# Altium schematic sheet MCU.SchDoc: Smart Nursery Guardian
size 584 x 243 mm; DrawnBy: Tharaa Mohamed; Organization: Team 6 Mind Cloud; Revision: V1.0; SheetNumber: 2; SheetTotal: 2
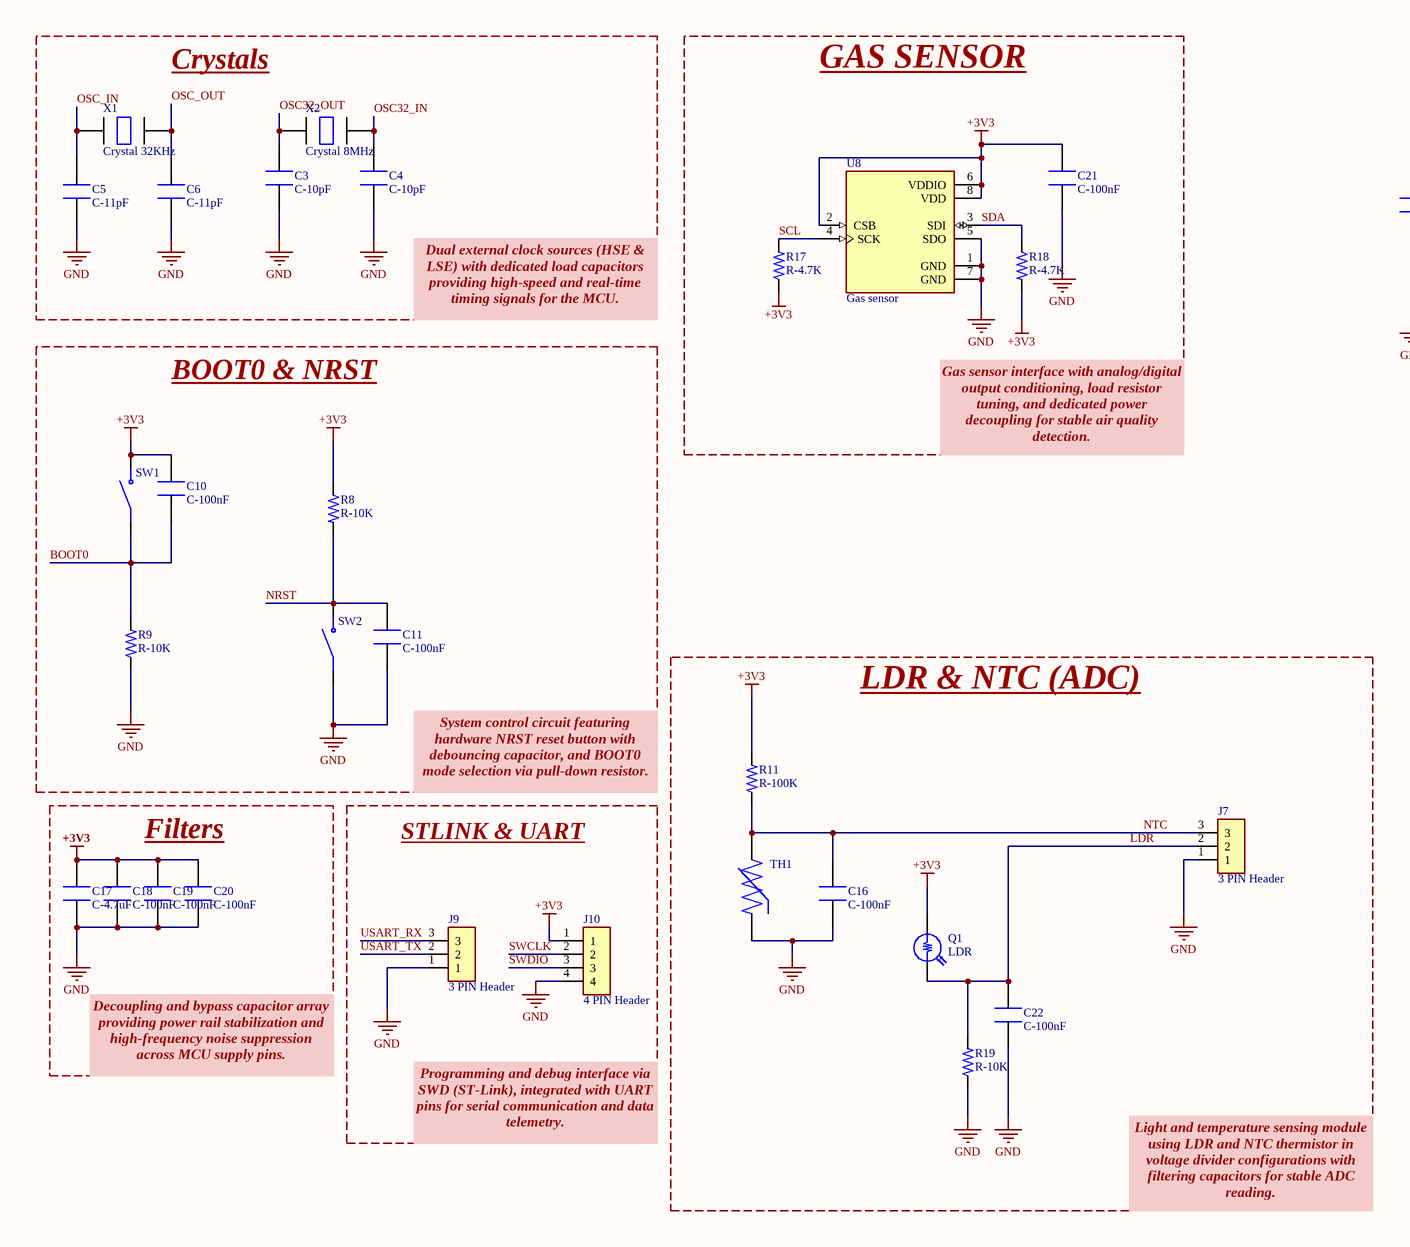
[diagram p0: MCU.SchDoc, left]
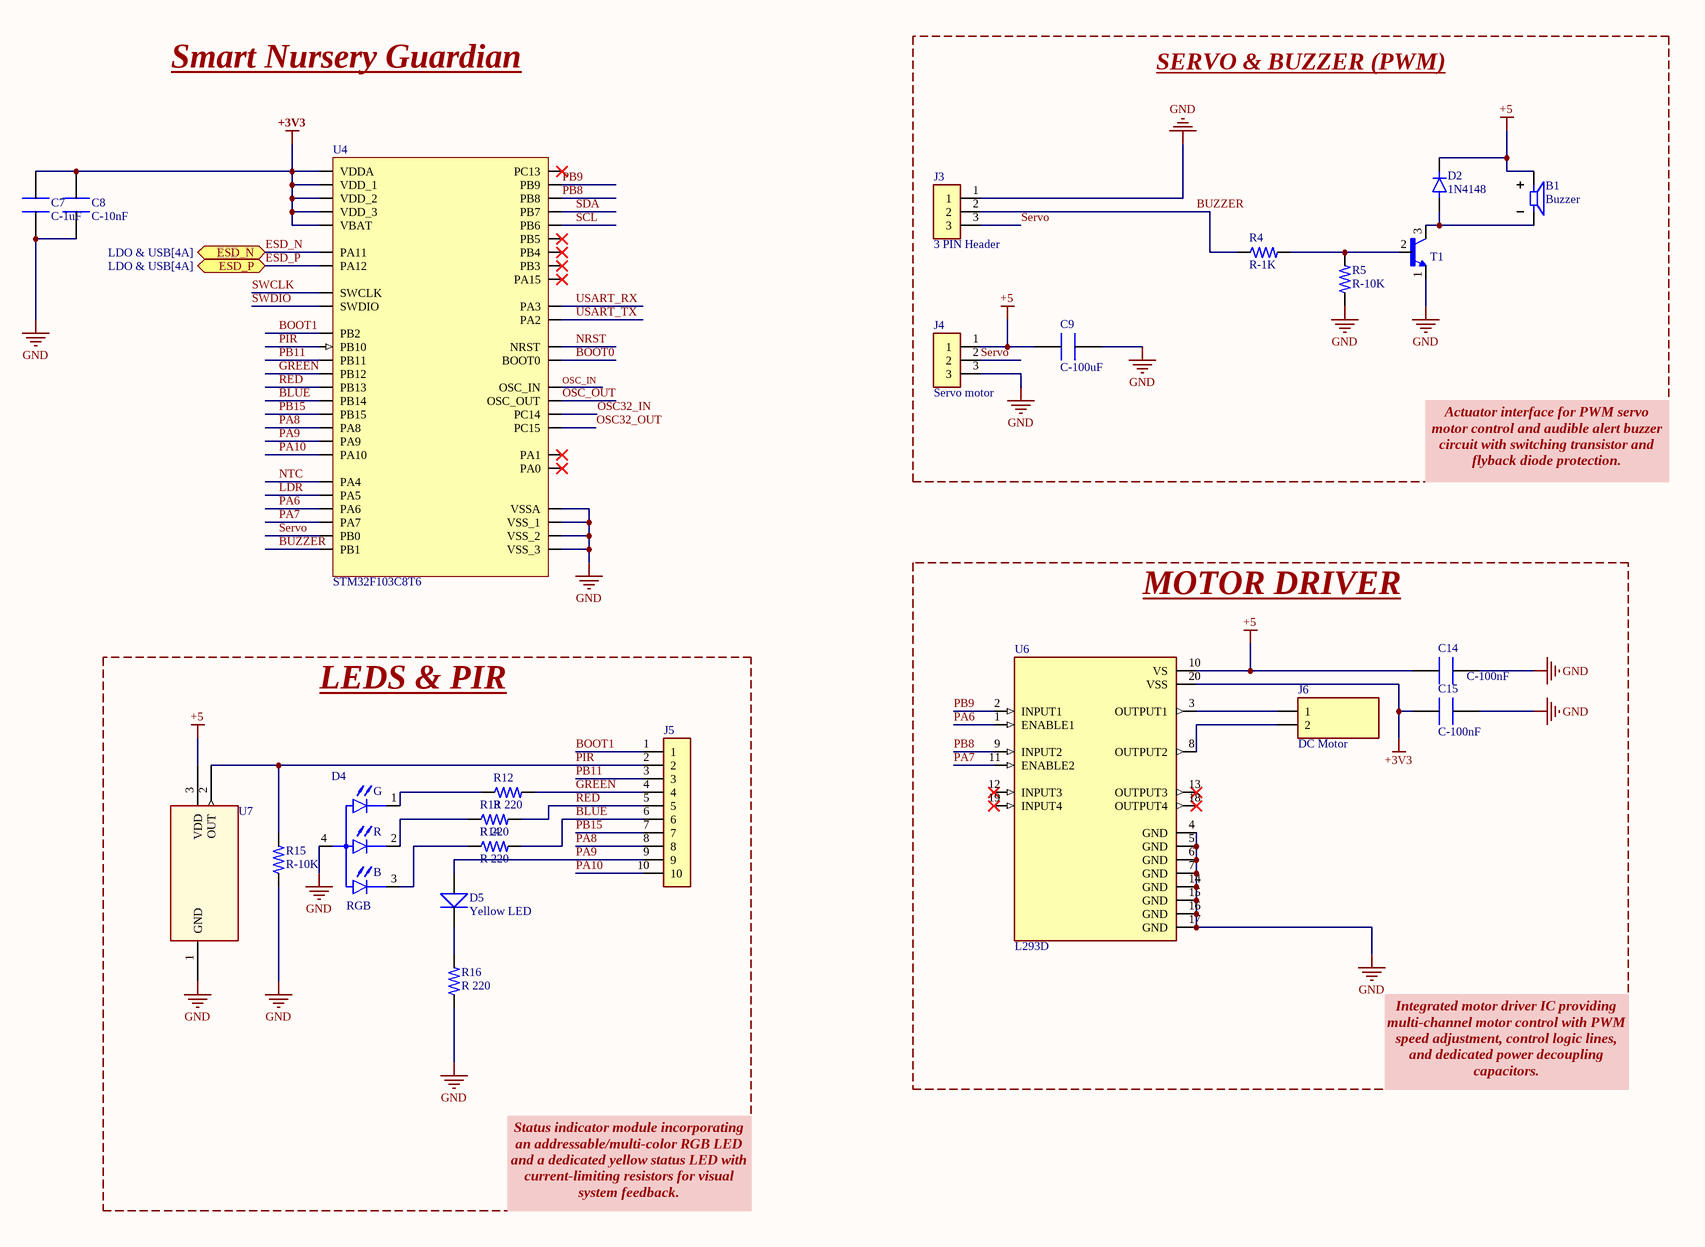
[diagram p1: MCU.SchDoc, right]

## Parts
B1  Buzzer  [Buzzer]
C3  C-10pF  [C-10pF]
C4  C-10pF  [C-10pF]
C5  C-11pF  [C-10pF]
C6  C-11pF  [C-10pF]
C7  C-1uF  [CAPC0804X80N]
C8  C-10nF  [CAPC0804X80N]
C9  C-100uF  [CAPC1709X35N]
C10  C-100nF  [CAPC1007X45N]
C11  C-100nF  [CAPC1007X45N]
C14  C-100nF  [CAPC1007X45N]
C15  C-100nF  [CAPC1007X45N]
C16  C-100nF  [CAPC1007X45N]
C17  C-4.7uF  [CAPC1007X45N]
C18  C-100nF  [CAPC1007X45N]
C19  C-100nF  [CAPC1007X45N]
C20  C-100nF  [CAPC1007X45N]
C21  C-100nF  [CAPC1007X45N]
C22  C-100nF  [CAPC1007X45N]
D2  1N4148  [DIOM3413X180N]
D4  RGB  [RGB]
D5  Yellow LED  [Green LED]
J3  3 PIN Header  [PIN 3 Header]
J4  Servo motor  [PIN 3 Header]
J5  10 PIN Header  [10 PIN Header]  (value not drawn)
J6  DC Motor  [2 PIN Header]
J7  3 PIN Header  [PIN 3 Header]
J9  3 PIN Header  [PIN 3 Header]
J10  4 PIN Header  [Header 4pin]
Q1  LDR  [LDR]
R4  R-1K  [RESC0804X45N]
R5  R-10K  [R-10K]
R8  R-10K  [R-10K]
R9  R-10K  [R-10K]
R11  R-100K  [RESC0503X35N]
R12  R 220  [R-220]
R13  R 220  [R-220]
R14  R 220  [R-220]
R15  R-10K  [R-10K]
R16  R 220  [R-220]
R17  R-4.7K  [RESC1007X50N]
R18  R-4.7K  [RESC1007X50N]
R19  R-10K  [R-10K]
SW1  SWITCH  [SWITCH]  (value not drawn)
SW2  SWITCH  [SWITCH]  (value not drawn)
T1  2N2222  [2N2222]  (value not drawn)
TH1  NTC Thermistor  [NTC]  (value not drawn)
U4  STM32F103C8T6  [STM32]
U6  L293D  [L293D]
U7  PIR  [PIR]  (value not drawn)
U8  Gas sensor  [Gas sensor]
X1  Crystal 32KHz  [Crystal 32KHz]
X2  Crystal 8MHz  [crystal 8Mz]

## Blocks framed on the sheet
Crystals: C3-C6 X1 X2
GAS SENSOR: C21 R17 R18 U8
SERVO & BUZZER (PWM): B1 C9 D2 J3 J4 R4 R5 T1
BOOT0 & NRST: C10 C11 R8 R9 SW1 SW2
MOTOR DRIVER: C14 C15 J6 U6
LDR & NTC (ADC): C16 C22 J7 Q1 R11 R19 TH1
LEDS & PIR: D4 D5 J5 R12-R16 U7
Filters: C17-C20
STLINK & UART: J9 J10

## Ports
ESD_N (bidir, see LDO & USB[4A]), ESD_P (bidir, see LDO & USB[4A])

## Nets
+3V3: C7.2 C8.2 C10.2 C15.1 C17.2 C18.2 C19.2 C20.2 C21.2 J10.1 Q1.1 R8.1 R11.2 R17.1 R18.2 SW1.2 U4.1(VBAT) U4.9(VDDA) U4.24(VDD_1) U4.36(VDD_2) U4.48(VDD_3) U6.20(VSS) U8.2(CSB) U8.6(VDDIO) U8.8(VDD)
+5: B1.P C9.1 C14.2 D2.K J4.1 U6.10(VS) U7.3(VDD)
GND: C3.1 C4.1 C5.1 C6.1 C7.1 C8.1 C9.2 C11.1 C14.1 C15.2 C16.1 C17.1 C18.1 C19.1 C20.1 C21.1 C22.1 D4.4(A) J3.1 J4.3 J7.1 J9.1 J10.4 R5.1 R9.1 R15.1 R16.1 R19.1 SW2.1 T1.1(E) TH1.1 U4.8(VSSA) U4.23(VSS_1) U4.35(VSS_2) U4.47(VSS_3) U6.4(GND) U6.5(GND) U6.6(GND) U6.7(GND) U6.14(GND) U6.15(GND) U6.16(GND) U6.17(GND) U7.1(GND) U8.1(GND) U8.5(SDO) U8.7(GND)
BLUE: J5.6 R14.2 U4.27(PB14)
BOOT0: C10.1 R9.2 SW1.1 U4.44(BOOT0)
BOOT1: J5.1 U4.20(PB2)
BUZZER: J3.2 R4.1 U4.19(PB1)
ESD_N: U4.32(PA11) ; port ESD_N
ESD_P: U4.33(PA12) ; port ESD_P
GREEN: J5.4 R12.2 U4.25(PB12)
LDR: C22.2 J7.2 Q1.2 R19.2 U4.15(PA5)
NRST: C11.2 R8.2 SW2.2 U4.7(NRST)
NTC: C16.2 J7.3 R11.1 TH1.2 U4.14(PA4)
OSC32_IN: C4.2 U4.3(PC14) X2.2
OSC32_OUT: C3.2 U4.4(PC15) X2.1
OSC_IN: C5.2 U4.5(OSC_IN) X1.1
OSC_OUT: C6.2 U4.6(OSC_OUT) X1.2
PA6: U4.16(PA6) U6.1(ENABLE1)
PA7: U4.17(PA7) U6.11(ENABLE2)
PA8: J5.8 U4.29(PA8)
PA9: D5.2 J5.9 U4.30(PA9)
PA10: J5.10 U4.31(PA10)
PB8: U4.45(PB8) U6.9(INPUT2)
PB9: U4.46(PB9) U6.2(INPUT1)
PB11: J5.3 U4.22(PB11)
PB15: J5.7 U4.28(PB15)
PIR: J5.2 R15.2 U4.21(PB10) U7.2(OUT)
RED: J5.5 R13.2 U4.26(PB13)
SCL: R17.2 U4.42(PB6) U8.4(SCK)
SDA: R18.1 U4.43(PB7) U8.3(SDI)
Servo: J3.3 J4.2 U4.18(PB0)
SWCLK: J10.2 U4.37(SWCLK)
SWDIO: J10.3 U4.34(SWDIO)
USART_RX: J9.3 U4.13(PA3)
USART_TX: J9.2 U4.12(PA2)
NetB1_N: B1.N D2.A T1.3(C)
NetD4_1: D4.1(C1) R12.1
NetD4_2: D4.2(C2) R13.1
NetD4_3: D4.3(C3) R14.1
NetD5_1: D5.1 R16.2
NetJ6_1: J6.1 U6.3(OUTPUT1)
NetJ6_2: J6.2 U6.8(OUTPUT2)
NetR4_2: R4.2 R5.2 T1.2(B)

Not connected (* = marked no-connect by the designer): U4 2(PC13)* 10(PA0)* 11(PA1)* 38(PA15)* 39(PB3)* 40(PB4)* 41(PB5)*; U6 12(INPUT3)* 13(OUTPUT3)* 18(OUTPUT4)* 19(INPUT4)*

## Notes on the sheet
- Smart Nursery Guardian
- Dual external clock sources (HSE & LSE) with dedicated load capacitors providing high-speed and real-time timing signals for the MCU.
- Gas sensor interface with analog/digital output conditioning, load resistor tuning, and dedicated power decoupling for stable air quality detection.
- Actuator interface for PWM servo motor control and audible alert buzzer circuit with switching transistor and flyback diode protection.
- System control circuit featuring hardware NRST reset button with debouncing capacitor, and BOOT0 mode selection via pull-down resistor.
- Decoupling and bypass capacitor array providing power rail stabilization and high-frequency noise suppression across MCU supply pins.
- Integrated motor driver IC providing multi-channel motor control with PWM speed adjustment, control logic lines, and dedicated power decoupling capacitors.
- Programming and debug interface via SWD (ST-Link), integrated with UART pins for serial communication and data telemetry.
- Light and temperature sensing module using LDR and NTC thermistor in voltage divider configurations with filtering capacitors for stable ADC reading.
- Status indicator module incorporating an addressable/multi-color RGB LED and a dedicated yellow status LED with current-limiting resistors for visual system feedback.
- (in symbol RGB) G; R; B

## Library data of the parts
B1 = Buzzer: Through Hole Alarms, Buzzers, and Sirens RoHS; MFR: CUI; MFR Part#: CMI-1210-5-95T; Supplier: LCSC; Supplier Part#: C6485139; ComponentLink1Description: New link; ComponentLink1URL: https://www.lcsc.com/product-detail/C6485139.html?s_z=n_q_CMI-1210-5-95T&spm=wm.fly.bg.0.xh&lcsc_vid=T1EIXgIEFgJdUgdfFAVeA1ADFlcIAQJWFVRdA1ZXFlMxVlNeT1JbX1FfQ1lXVDsOAxUeFF5JWBYZEEoKFBINSQcJGk4eFQsCAgIaSgADAwAHC0slRlNXVlFXWQkaCgg%3D
C3 C4 = C-10pF: MFR: Samsung Electro-Mechanics; MFR PART #: CL10C100JB8NNNC; SUPPLIER: LCSC; SUPPLIER PART #: C1634; ComponentLink1Description: New link; ComponentLink1URL: C1634
C5 C6 = C-11pF: MFR: muRata; MFR PART: GRM0335C1E110JA01D; SUPPLIER: LCSC; SUPPLIER PART #: C2183483
C7 = C-1uF: MFR: Samsung Electro-Mechanics; MFR PART#: CL10B105KA8NNNC; SUPPLIER: LCSC; ComponentLink1Description: New link; ComponentLink1URL: https://www.lcsc.com/product-detail/C29936.html?s_z=n_q_t_Capacitor%25201uF&spm=wm.fly.bg.0.cbh___wm.ssy.tc.0.tz&lcsc_vid=QgVYVVJWE1VfXwZQRQQNBFIETgIPBFxQQFYPXlAFEgMxVlNeQFJXUFdQT1hcVzsOAxUeFF5JWBYZEEoKFBINSQcJGk4eFQsCAgIaSgADAwAHC0slRlFeV1BUWQkaCgg%3D; SUPPLIER PART#: C29936
C8 = C-10nF: MFR: YAGEO; MFR PART #: CC0603KRX7R9BB103; SUPPLIER: LCSC; SUPPLIER PART#: C100042; ComponentLink1Description: New link; ComponentLink1URL: https://www.lcsc.com/product-detail/C100042.html?s_z=n_q_t_capacitor%252010nf&spm=wm.fly.bg.0.cbh___wm.ssy.tc.0.tz&lcsc_vid=QgVYVVJWE1VfXwZQRQQNBFIETgIPBFxQQFYPXlAFEgMxVlNeQFJXUFVVQFVZXjsOAxUeFF5JWBYZEEoKFBINSQcJGk4eFQsCAgIaSgADAwAHC0slRlBWVVxeWQkaCgg%3D
C9 = C-100uF: CAP CER 100uF 6.3V X5R 1206; MFR: Samsung Electro-Mechanics; MFR Part#: CL31A107MQHNNNE; ComponentLink1Description: New link; ComponentLink1URL: https://www.lcsc.com/product-detail/C15008.html?s_z=n_q_t_Capacitor%2520100u&spm=wm.fly.bg.0.xh___wm.ssy.tc.0.tz&lcsc_vid=T1EIXgIEFgJdUgdfFAVeA1ADFlcIAQJWFVRdA1ZXFlMxVlNeT1JZV1BfR1VbUTsOAxUeFF5JWBYZEEoKFBINSQcJGk4NBhADEA4cHktRTlNADxALGw%3D%3D; Supplier: LCSC; Supplier Part#: C15008
C10 C11 C14-C16 C18-C22 = C-100nF: MFR: TDK; MFR PART#: CGA5L2X7R2A104KT0Y0U; SUPPLIER: LCSC; SUPPLIER PART#: C338057; ComponentLink1Description: New link; ComponentLink1URL: https://www.lcsc.com/product-detail/C338057.html?s_z=n_q_C338057&globalKeyword=C338057
C17 = C-4.7uF: MFR: SAMYOUNG; MFR PART #: MVK 50V4.7 5*5.2; SUPPLIER: LCSC; SUPPLIER PART #: C165626; ComponentLink1Description: New link; ComponentLink1URL: https://www.lcsc.com/product-detail/C165626.html?s_z=n_q_C165626&globalKeyword=C165626
D2 = 1N4148: DIODE GP 100V 200mA DO-35; MFR: onsemi; MFR Part#: 1N4148; Supplier: LCSC; Supplier Part#: C258182; ComponentLink1Description: New link; ComponentLink1URL: https://www.lcsc.com/product-detail/C258182.html?s_z=n_q_x_1N4148&spm=wm.ssy.em.0.tz&lcsc_vid=T1EIXgIEFgJdUgdfFAVeA1ADFlcIAQJWFVRdA1ZXFlMxVlNeT1JbXlNXRVlfUTsOAxUeFF5JWBYZEEoKFBINSQcJGk4eFQsCAgIaSgADAwAHC0slRVFYVlJVRlhADxALGw%3D%3D
D4 = RGB: 12x12 Red, Green, Blue(RGB) LED Dot Matrix and Cluster RoHS; MFR: Inolux; MFR Part#: INCM88001; Supplier: LCSC; Supplier Part#: C7288959; ComponentLink1Description: New link; ComponentLink1URL: https://www.lcsc.com/product-detail/C7288959.html?s_z=n_q_t_RGB%2520LED&spm=wm.fly.bg.0.xh___wm.ssy.tc.0.tz&lcsc_vid=T1EIXgIEFgJdUgdfFAVeA1ADFlcIAQJWFVRdA1ZXFlMxVlNeT1JYVVBXTlBYVjsOAxUeFF5JWBYZEEoKFBINSQcJGk4eFQsCAgIaSgADAwAHC0slRVRWVlxUWQkaCgg%3D
D5 = Yellow LED: LED YELLOW WATER CLEAR 0402 SMD; MFR: YONGYUTAI; MFR Part#: YLED0402Y; Supplier: LCSC; Supplier Part#: C20608782; ComponentLink1Description: New link; ComponentLink1URL: https://www.lcsc.com/product-detail/C20608782.html?s_z=n_q_t_Yellow%2520led&spm=wm.fly.bg.0.xh___wm.ssy.tc.0.tz&lcsc_vid=T1EIXgIEFgJdUgdfFAVeA1ADFlcIAQJWFVRdA1ZXFlMxVlNeT1JYVFBRQFZbUDsOAxUeFF5JWBYZEEoKFBINSQcJGk4eFQsCAgIaSgADAwAHC0slQFNWX11TTk8GEwkK
J4 = 3 PIN Header: Parameter 1: *; Parameter 2: *; Parameter 3: *; Parameter 4: *; ComponentLink1Description: New link; ComponentLink1URL: *
J6 = 2 PIN Header: Pin Header 2 Position Dual Row Through Hole -55℃~+125℃; MFR: Samtec; MFR Part#: MTSW-101-09-L-D-515; Supplier: LCSC; Supplier Part#: C5684114; ComponentLink1Description: New link; ComponentLink1URL: https://www.lcsc.com/product-detail/C5684114.html?s_z=n_q_MTSW-101-09-L-D-515&spm=wm.fly.bg.0.cbh&lcsc_vid=T1EIXgIEFgJdUgdfFAVeA1ADFlcIAQJWFVRdA1ZXFlMxVlNeT1JYX1JeRVhXUjsOAxUeFF5JWBYZEEoKFBINSQcJGk4eFQsCAgIaSgADAwAHC0slRVhZVlZfRE8GEwkK
J10 = 4 PIN Header: MFR: hanxia; MFR PART #: HX PH254-01-04-Z-L11.5 straight pin header; SUPPLIER: LCSC; SUPPLIER PART #: C52016392; ComponentLink1Description: New link; ComponentLink1URL: https://www.lcsc.com/product-detail/C52016392.html?s_z=n_q_t_4%2520PIN%2520Header&spm=wm.fly.bg.0.xh___wm.ssy.tc.0.tz&lcsc_vid=QgVYVVJWE1VfXwZQRQQNBFIETgIPBFxQQFYPXlAFEgMxVlNeQFVcUFVeQFNaVjsOAxUeFF5JWBYZEEoKFBINSQcJGk4eFQsCAgIaSgADAwAHC0slRVNXUVZIHxUDCw%3D%3D
Q1 = LDR: Silicon NPN Phototransistor, RoHS Compliant; MFR: VISHAY; MFR Part#: TEMT1020; Supplier: LCSC; Supplier Part#: C129151; ComponentLink1Description: New link; ComponentLink1URL: https://www.lcsc.com/product-detail/C129151.html?s_z=n_q_TEMT1020&spm=wm.fly.bg.0.xh&lcsc_vid=T1EIXgIEFgJdUgdfFAVeA1ADFlcIAQJWFVRdA1ZXFlMxVlNeT1JbUFFXRVNdVzsOAxUeFF5JWBYZEEoKFBINSQcJGk4NBhADEA4cHktXRVZcSQwSGg0%3D
R4 = R-1K: MFR: FOJAN; MFR PART #: FRC0603F1001TS; SPN PART#: C2907002; SPN: LCSC; ComponentLink1Description: New link; ComponentLink1URL: https://www.lcsc.com/product-detail/C2907002.html?s_z=n_q_t_Resistor%25201k&spm=wm.fly.bg.0.cbh___wm.ssy.tc.0.tz&lcsc_vid=QgVYVVJWE1VfXwZQRQQNBFIETgIPBFxQQFYPXlAFEgMxVlNeQFRWX1ZeRFddVzsOAxUeFF5JWBYZEEoKFBINSQcJGk4eFQsCAgIaSgADAwAHC0slQlZZVVVXWQkaCgg%3D
R5 R8 R9 R15 R19 = R-10K: MFR: YAGEO; MFR PART#: RC0603FR-0710KL; SPN PART #: C98220; SPN: LCSC; ComponentLink1Description: New link; ComponentLink1URL: https://www.lcsc.com/product-detail/C98220.html?s_z=n_q_t_Resistor%252010k&spm=wm.fly.bg.0.cbh___wm.ssy.tc.0.tz&lcsc_vid=QgVYVVJWE1VfXwZQRQQNBFIETgIPBFxQQFYPXlAFEgMxVlNeQFVWUlxQQVNaUDsOAxUeFF5JWBYZEEoKFBINSQcJGk4eFQsCAgIaSgADAwAHC0slRVZXXlFWT08GEwkK
R11 = R-100K: RES 100kΩ ±1% 62.5mW 0402; MFR: YAGEO; MFR part#: RC0402FR-07100KL; Supplier: LCSC; Supplier part#: C60491; ComponentLink1Description: New link; ComponentLink1URL: https://www.lcsc.com/product-detail/C60491.html?s_z=n_q_t_Resistor%2520100&spm=wm.fly.bg.2.xh___wm.ssy.tc.0.tz&lcsc_vid=T1EIXgIEFgJdUgdfFAVeA1ADFlcIAQJWFVRdA1ZXFlMxVlNeT1JbU1FWRFFaVDsOAxUeFF5JWBYZEEoKFBINSQcJGk4eFQsCAgIaSgADAwAHC0slQ1NYUVFSWQkaCgg%3D
R12-R14 R16 = R 220: MFR: UNI-ROYAL; MFR PART #: 0603WAF2200T5E; SUPPLIER: LCSC; SUPPLIER PART #: C22962; ComponentLink1Description: New link; ComponentLink1URL: https://www.lcsc.com/product-detail/C22962.html?s_z=n_q_t_Resistor%2520220&spm=wm.fly.bg.0.cbh___wm.ssy.tc.0.tz&lcsc_vid=QgVYVVJWE1VfXwZQRQQNBFIETgIPBFxQQFYPXlAFEgMxVlNeQFVcUVFXRFlbXjsOAxUeFF5JWBYZEEoKFBINSQcJGk4dAgUUFAk%3D
R17 R18 = R-4.7K: RES 4.7kΩ ±1% 100mW 0603; MFR: YAGEO; MFR Part#: RC0603FR-074K7L; SPN Part#: C99782; SPN: LCSC; ComponentLink1Description: New link; ComponentLink1URL: https://www.lcsc.com/product-detail/C99782.html?s_z=n_q_t_Resistor%25204.7&spm=wm.fly.bg.0.xh___wm.ssy.tc.0.tz&lcsc_vid=T1EIXgIEFgJdUgdfFAVeA1ADFlcIAQJWFVRdA1ZXFlMxVlNeT1JZXlBQQFlfVjsOAxUeFF5JWBYZEEoKFBINSQcJGk4eFQsCAgIaSgADAwAHC0slRFFXU1FVQU8GEwkK
SW1 SW2 = SWITCH: MFR: C&K; MFR PART#: L101011ML04Q; SPN PART #: C2799508; SPN: LCSC; ComponentLink1Description: New link; ComponentLink1URL: https://www.lcsc.com/product-detail/C2799508.html?s_z=n_q_L101011ML04Q&spm=wm.fly.bg.0.cbh&lcsc_vid=QgVYVVJWE1VfXwZQRQQNBFIETgIPBFxQQFYPXlAFEgMxVlNeQFVWUlBeT1BYVDsOAxUeFF5JWBYZEEoKFBINSQcJGk4NBhADEA4cHktRTlNADxALGw%3D%3D
T1 = 2N2222: NPN Plastic-Encapsulate Transistors; MFR: HXY MOSFET; MFR Part#: 2N2222A; Supplier: LCSC; Supplier Part#: C20616319; ComponentLink1Description: New link; ComponentLink1URL: https://www.lcsc.com/product-detail/C20616319.html?s_z=n_q_x_2N2222A&spm=wm.ssy.em.0.tz&lcsc_vid=T1EIXgIEFgJdUgdfFAVeA1ADFlcIAQJWFVRdA1ZXFlMxVlNeT1JbXlRVT1ZXXjsOAxUeFF5JWBYZEEoKFBINSQcJGk4NBhADEA4cHktXQFJaSQwSGg0%3D
TH1 = NTC Thermistor: THERMISTOR NTC 100kΩ 4250K 0402; MFR: muRata; MFR Part#: NCU15WF104D60RC; Supplier: LCSC; Supplier part#: C426654; ComponentLink1Description: New link; ComponentLink1URL: https://www.lcsc.com/product-detail/C426654.html?s_z=n_q_NCU15WF104D60RC&spm=wm.fly.bg.0.xh&lcsc_vid=T1EIXgIEFgJdUgdfFAVeA1ADFlcIAQJWFVRdA1ZXFlMxVlNeT1JbVFFRT1FcXjsOAxUeFF5JWBYZEEoKFBINSQcJGk4MFQUIE0wKAhAHHg1BVl1fWQkaCgg%3D
U4 = STM32F103C8T6: Medium-density performance line Arm-based 32-bit MCU with 64 or 128 KB Flash, USB, CAN, 7 timers, 2 ADCs, 9 com. interfaces; MFR: ST; MFR PART #: STM32F103C8T6; SUPPLIER: LSCS; SUPPLIER PART #: C8734; ComponentLink1Description: DATASHEET; ComponentLink1URL: https://www.lcsc.com/datasheet/C8734.pdf?spm=wm.sxq.inf.ggs___wm.ssy.bg.0.xh&lcsc_vid=QgVYVVJWE1VfXwZQRQQNBFIETgIPBFxQQFYPXlAFEgMxVlNeQFJcUFVVRVZXXjsOAxUeFF5JWBYZEEoKFBINSQcJGk4%3D; ComponentLink2Description: LSCS; ComponentLink2URL: https://www.lcsc.com/product-detail/C8734.html?s_z=n_q_p_STM32F10C8T6&spm=wm.ssy.bg.0.xh&lcsc_vid=QgVYVVJWE1VfXwZQRQQNBFIETgIPBFxQQFYPXlAFEgMxVlNeQFJcUFVVRVZXXjsOAxUeFF5JWBYZEEoKFBINSQcJGk4%3D
U6 = L293D: PUSH-PULL FOUR CHANNEL DRIVER WITH DIODES; MFR: ST; MFR Part#: L293DD; Supplier: LCSC; Supplier Part#: C2971293; ComponentLink1Description: New link; ComponentLink1URL: https://www.lcsc.com/product-detail/C2971293.html?s_z=n_q_x_L293DD&spm=wm.ssy.em.0.tz&lcsc_vid=T1EIXgIEFgJdUgdfFAVeA1ADFlcIAQJWFVRdA1ZXFlMxVlNeT1JYUFdeT1dZVzsOAxUeFF5JWBYZEEoKFBINSQcJGk4NBhADEA4cHktSRlFADxALGw%3D%3D
U7 = PIR: PIRs motion sensor; MFR: PANASONIC; MFR Part#: EKMC1601111; Supplier: LCSC; Supplier Part#: C2684441; ComponentLink1Description: New link; ComponentLink1URL: https://www.lcsc.com/product-detail/C2684441.html?s_z=n_q_EKMC1601111&spm=wm.fly.bg.0.xh&lcsc_vid=T1EIXgIEFgJdUgdfFAVeA1ADFlcIAQJWFVRdA1ZXFlMxVlNeT1JbUVdSTllbUTsOAxUeFF5JWBYZEEoKFBINSQcJGk4NBhADEA4cHktXRVRdSQwSGg0%3D
U8 = Gas sensor: MFR: Bosch; MFR Part#: BME688; Supplier: LCSC; Supplier Part #: C3664478; ComponentLink1Description: New link; ComponentLink1URL: https://www.lcsc.com/product-detail/C3664478.html?s_z=n_q_x_BME688&spm=wm.ssy.em.0.tz&lcsc_vid=T1EIXgIEFgJdUgdfFAVeA1ADFlcIAQJWFVRdA1ZXFlMxVlNeT1JZVFFWRVJXXjsOAxUeFF5JWBYZEEoKFBINSQcJGk4dAgUUFAk%3D
X1 = Crystal 32KHz: Crystal 32kHz ±100ppm 11pF 35kΩ DT-26; MFR: EPSON; MFR PART#: C-2 32.0000K-P:PBFREE; ComponentLink1Description: New link; ComponentLink1URL: https://www.lcsc.com/product-detail/C1669824.html?s_z=n_q_p_MC-306%252032.0000K-G%253A%2520PURE%2520SN.&spm=wm.ssy.bg.1.cbh&lcsc_vid=QgVYVVJWE1VfXwZQRQQNBFIETgIPBFxQQFYPXlAFEgMxVlNeQFVeV1NVQVVaVDsOAxUeFF5JWBYZEEoKFBINSQcJGk4NBhADEA4cHktXRlRbSQwSGg0%3D; SUPPLIER: LCSC; SUPPLIER PART #: C1669824
X2 = Crystal 8MHz: CRYSTAL 8MHz 12pF SMD; MFR: YXC Crystal Oscillators; MFR PART #: X32258MOB4SI; SUPPLIER: LCSC; SUPPLIER PART #: C2682775; ComponentLink1Description: New link; ComponentLink1URL: https://www.lcsc.com/product-detail/C2682775.html?s_z=n_q_crystal%25208&spm=wm.fly.bg.0.cbh&lcsc_vid=QgVYVVJWE1VfXwZQRQQNBFIETgIPBFxQQFYPXlAFEgMxVlNeQFJXX1JeQlVYUDsOAxUeFF5JWBYZEEoKFBINSQcJGk4eFQsCAgIaSgADAwAHC0slRFJWV1FRWQkaCgg%3D
J3 J7 J9 = 3 PIN Header
  J3 J7: Parameter 1: *; Parameter 2: *; Parameter 3: *; Parameter 4: *; ComponentLink1Description: New link; ComponentLink1URL: *